# EAGLE design casen (EAGLE 5.04)
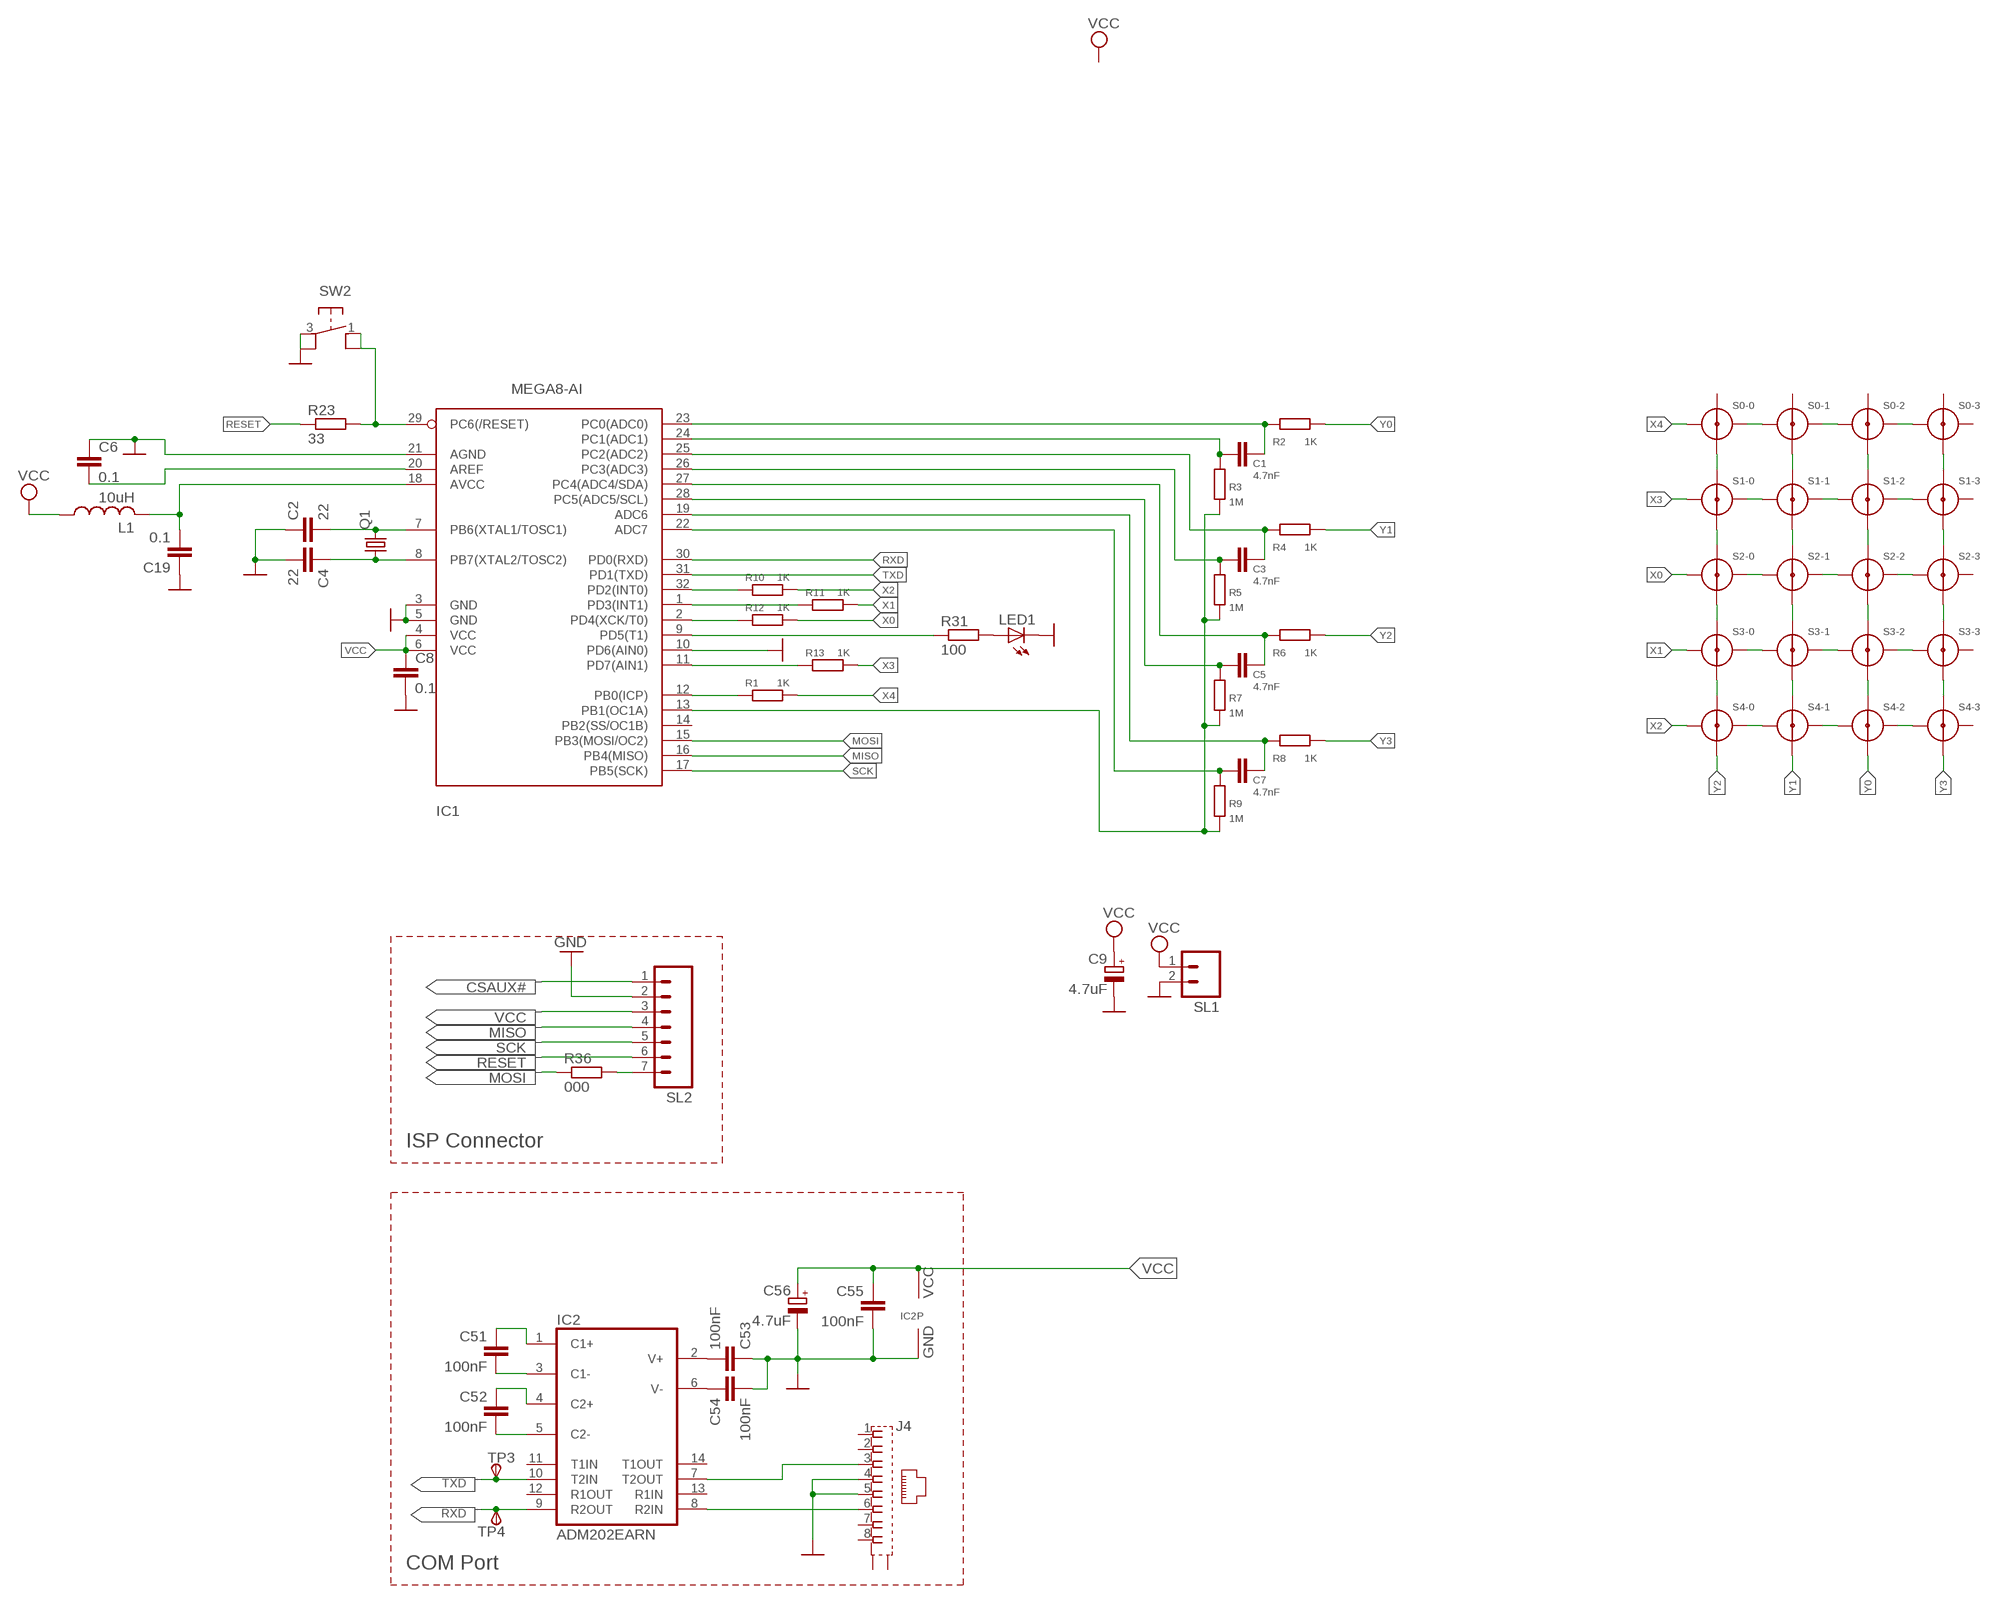
[diagram p0: schematic, sheet 1]

## Parts
C1  4.7nF  C-EUC0805S  [C0805S]
C2  22  C-EUC0805S  [C0805S]
C3  4.7nF  C-EUC0805S  [C0805S]
C4  22  C-EUC0805S  [C0805S]
C5  4.7nF  C-EUC0805S  [C0805S]
C6  0.1  C-EUC0603  [C0603]
C7  4.7nF  C-EUC0805S  [C0805S]
C8  0.1  C-EUC0603  [C0603]
C9  4.7uF  CPOL-EUB/3528-21R  [B/3528-21R]
C19  0.1  C-EUC0603  [C0603]
C51  100nF  C-EUC0603K  [C0603K]
C52  100nF  C-EUC0603K  [C0603K]
C53  100nF  C-EUC0603K  [C0603K]
C54  100nF  C-EUC0603K  [C0603K]
C55  100nF  C-EUC0603K  [C0603K]
C56  4.7uF  CPOL-EUA/3216-18R  [A/3216-18R]
IC1  MEGA8-AI  [TQFP32-08]
IC2  ADM202EARN  [SO16]
J4  558310-1  [558310-1]
L1  10uH  L-USL3216C  [L3216C]
LED1  LEDCHIP-LED0805  [CHIP-LED0805]
Q1  CRYTALHC49S  [HC49/S]
R1  1K  R-EU_R0805S  [R0805-SVO]
R2  1K  R-EU_R0805S  [R0805-SVO]
R3  1M  R-EU_R0805S  [R0805-SVO]
R4  1K  R-EU_R0805S  [R0805-SVO]
R5  1M  R-EU_R0805S  [R0805-SVO]
R6  1K  R-EU_R0805S  [R0805-SVO]
R7  1M  R-EU_R0805S  [R0805-SVO]
R8  1K  R-EU_R0805S  [R0805-SVO]
R9  1M  R-EU_R0805S  [R0805-SVO]
R10  1K  R-EU_R0805S  [R0805-SVO]
R11  1K  R-EU_R0805S  [R0805-SVO]
R12  1K  R-EU_R0805S  [R0805-SVO]
R13  1K  R-EU_R0805S  [R0805-SVO]
R23  33  R-EU_R0805S  [R0805-SVO]
R31  100  R-EU_R0402  [R0402]
R36  000  R-EU_R0805S  [R0805-SVO]
S0-0  CAPSENSOR110MM  [CAPSENSOR10MM]
S0-1  CAPSENSOR110MM  [CAPSENSOR10MM]
S0-2  CAPSENSOR110MM  [CAPSENSOR10MM]
S0-3  CAPSENSOR110MM  [CAPSENSOR10MM]
S1-0  CAPSENSOR110MM  [CAPSENSOR10MM]
S1-1  CAPSENSOR110MM  [CAPSENSOR10MM]
S1-2  CAPSENSOR110MM  [CAPSENSOR10MM]
S1-3  CAPSENSOR110MM  [CAPSENSOR10MM]
S2-0  CAPSENSOR110MM  [CAPSENSOR10MM]
S2-1  CAPSENSOR110MM  [CAPSENSOR10MM]
S2-2  CAPSENSOR110MM  [CAPSENSOR10MM]
S2-3  CAPSENSOR110MM  [CAPSENSOR10MM]
S3-0  CAPSENSOR110MM  [CAPSENSOR10MM]
S3-1  CAPSENSOR110MM  [CAPSENSOR10MM]
S3-2  CAPSENSOR110MM  [CAPSENSOR10MM]
S3-3  CAPSENSOR110MM  [CAPSENSOR10MM]
S4-0  CAPSENSOR110MM  [CAPSENSOR10MM]
S4-1  CAPSENSOR110MM  [CAPSENSOR10MM]
S4-2  CAPSENSOR110MM  [CAPSENSOR10MM]
S4-3  CAPSENSOR110MM  [CAPSENSOR10MM]
SL1  M02  [02P]
SL2  M07  [07P]
SW2  BUTTON_6X6_THRU  [6X6_BUTTON_THRU]
TP3  TPSTP18SQ  [TP18SQ]
TP4  TPSTP18SQ  [TP18SQ]

## Nets
COM_RXD: IC2.8(R2IN) J4.6
COM_TXD: IC2.7(T2OUT) J4.3
CSAUX#: SL2.1
GND: C2.1 C4.2 C6.1 C8.2 C9.- C19.1 C53.1 C54.2 C55.2 C56.- IC1.3(GND) IC1.5(GND) IC1.10(PD6(AIN0)) IC1.21(AGND) IC2.15(GND) J4.4 J4.5 LED1.C SL1.2 SL2.2 SW2.3(P1) SW2.4(P1)
MISO: IC1.16(PB4(MISO)) SL2.4
MOSI: IC1.15(PB3(MOSI/OC2)) R36.1
N$1: S0-0.Y$2 S1-0.Y$1
N$2: S1-0.Y$2 S2-0.Y$1
N$3: S2-0.Y$2 S3-0.Y$1
N$4: C51.2 IC2.3(C1-)
N$5: IC1.12(PB0(ICP)) R1.1
N$6: C6.2 IC1.20(AREF)
N$7: C51.1 IC2.1(C1+)
N$8: C52.1 IC2.4(C2+)
N$9: C52.2 IC2.5(C2-)
N$10: C53.2 IC2.2(V+)
N$11: S0-1.Y$2 S1-1.Y$1
N$12: S1-1.Y$2 S2-1.Y$1
N$13: S2-1.Y$2 S3-1.Y$1
N$14: S3-1.Y$2 S4-1.Y$1
N$15: C1.1 IC1.23(PC0(ADC0)) R2.1
N$16: C1.2 IC1.24(PC1(ADC1)) R3.1
N$17: C3.1 IC1.25(PC2(ADC2)) R4.1
N$18: C3.2 IC1.26(PC3(ADC3)) R5.1
N$19: C5.1 IC1.27(PC4(ADC4/SDA)) R6.1
N$20: C5.2 IC1.28(PC5(ADC5/SCL)) R7.1
N$21: C7.1 IC1.19(ADC6) R8.1
N$22: C7.2 IC1.22(ADC7) R9.1
N$23: IC1.29(PC6(/RESET)) R23.2 SW2.1(P2) SW2.2
N$24: S3-0.Y$2 S4-0.Y$1
N$25: S0-0.X$2 S0-1.X$1
N$26: C19.2 IC1.18(AVCC) L1.2
N$27: IC1.32(PD2(INT0)) R10.1
N$28: C2.2 IC1.7(PB6(XTAL1/TOSC1)) Q1.2
N$29: C4.1 IC1.8(PB7(XTAL2/TOSC2)) Q1.1
N$30: IC1.1(PD3(INT1)) R11.1
N$31: IC1.2(PD4(XCK/T0)) R12.1
N$32: IC1.11(PD7(AIN1)) R13.1
N$33: S1-0.X$2 S1-1.X$1
N$34: S2-0.X$2 S2-1.X$1
N$35: S3-0.X$2 S3-1.X$1
N$36: S4-0.X$2 S4-1.X$1
N$37: S0-2.Y$2 S1-2.Y$1
N$38: S1-2.Y$2 S2-2.Y$1
N$39: S2-2.Y$2 S3-2.Y$1
N$40: S3-2.Y$2 S4-2.Y$1
N$41: S0-1.X$2 S0-2.X$1
N$42: S1-1.X$2 S1-2.X$1
N$43: S2-1.X$2 S2-2.X$1
N$44: S3-1.X$2 S3-2.X$1
N$45: S4-1.X$2 S4-2.X$1
N$46: S0-3.Y$2 S1-3.Y$1
N$47: S1-3.Y$2 S2-3.Y$1
N$48: S2-3.Y$2 S3-3.Y$1
N$49: LED1.A R31.2
N$50: S3-3.Y$2 S4-3.Y$1
N$51: IC1.9(PD5(T1)) R31.1
N$52: S0-2.X$2 S0-3.X$1
N$53: S1-2.X$2 S1-3.X$1
N$54: S2-2.X$2 S2-3.X$1
N$55: S3-2.X$2 S3-3.X$1
N$56: S4-2.X$2 S4-3.X$1
N$57: C54.1 IC2.6(V-)
N$78: R36.2 SL2.7
RESET: R23.1 SL2.6
RXD: IC1.30(PD0(RXD)) IC2.9(R2OUT) TP4.TP(PP)
SCK: IC1.17(PB5(SCK)) SL2.5
SLOPE: IC1.13(PB1(OC1A)) R3.2 R5.2 R7.2 R9.2
TXD: IC1.31(PD1(TXD)) IC2.10(T2IN) TP3.TP(PP)
VCC: C8.1 C9.+ C55.1 C56.+ IC1.4(VCC) IC1.6(VCC) IC2.16(VCC) L1.1 SL1.1 SL2.3
X0: R12.2 S2-0.X$1
X1: R11.2 S3-0.X$1
X2: R10.2 S4-0.X$1
X3: R13.2 S1-0.X$1
X4: R1.2 S0-0.X$1
Y0: R2.2 S4-2.Y$2
Y1: R4.2 S4-1.Y$2
Y2: R6.2 S4-0.Y$2
Y3: R8.2 S4-3.Y$2
Unconnected: IC1.14(PB2(SS/OC1B)) IC2.11(T1IN) IC2.12(R1OUT) IC2.13(R1IN) IC2.14(T1OUT) J4.1 J4.2 J4.7 J4.8 J4.G1(S2) J4.G2(S1) S0-0.Y$1 S0-1.Y$1 S0-2.Y$1 S0-3.X$2 S0-3.Y$1 S1-3.X$2 S2-3.X$2 S3-3.X$2 S4-3.X$2

## Notes on the sheet
- ISP Connector
- COM Port

## Library data of the parts
C1-C8 C19 C51-C55 = rcl:C-EU: CAPACITOR, European symbol
C9 C56 = rcl:CPOL-EU: POLARIZED CAPACITOR, European symbol
IC1 = atmel:MEGA8: MICROCONTROLLER 8 Kbytes FLASH, 1 kbytes SRAM, 512 bytes EEPROM, USART, 6-channel 10 bit ADC, 2-channel 8 bit ADC Pin compatible with Atmega48, ATMega88, ATMega168 Source: avr.lbr
IC2 = 0-ADI-variety:ADM202E*
J4 = con-amp:558310-1: AMP connector
L1 = rcl:L-US: INDUCTOR, American symbol
LED1 = led:LED: LED OSRAM: - CHIPLED LG R971, LG N971, LY N971, LG Q971, LY Q971, LO R971, LY R971 LH N974, LH R974 LS Q976, LO Q976, LY Q976 LO Q996 - Hyper CHIPLED LW Q18S LB Q993, LB Q99A, LB R99A - SideLED LS A670, LO A670, LY A670, LG A670, LP A670 LB A673, LV A673, LT A673, LW A673 LH A674 LY A675 LS A676, LA A676, LO A676, LY A676, LW A676 LS A679, LY A679, LG A679 - Hyper Micro SIDELED® LS Y876, LA Y876, LO Y876, LY Y876 LT Y87S - SmartLED LW L88C, LW L88S LB L89C, LB L89S, LG L890 LS L89K, LO L89K, LY L89K LS L896, LA L896, LO L896, LY L896 - TOPLED LS T670, LO T670, LY T670, LG T670, LP T670 LSG T670, LSP T670, LSY T670, LOP T670, LYG T670 LG T671, LOG T671, LSG T671 LB T673, LV T673, LT T673, LW T673 LH T674 LS T676, LA T676, LO T676, LY T676, LB T676, LH T676, LSB T676, LW T676 LB T67C, LV T67C, LT T67C, LS T67K, LO T67K, LY T67K, LW E67C LS E67B, LA E67B, LO E67B, LY E67B, LB E67C, LV E67C, LT E67C LW T67C LS T679, LY T679, LG T679 LS T770, LO T770, LY T770, LG T770, LP T770 LB T773, LV T773, LT T773, LW T773 LH T774 LS E675, LA E675, LY E675, LS T675 LS T776, LA T776, LO T776, LY T776, LB T776 LHGB T686 LT T68C, LB T68C - Hyper Mini TOPLED® LB M676 - Mini TOPLED Santana® LG M470 LS M47K, LO M47K, LY M47K Source: http://www.osram.convergy.de/
Q1 = crystal:CRYTAL: CRYSTAL
R1-R13 R23 R31 R36 = rcl:R-EU_: RESISTOR, European symbol
S0-0 S0-1-S0-3 S1-0 S1-1-S1-3 S2-0 S2-1-S2-3 S3-0 S3-1-S3-3 S4-0 S4-1-S4-3 = 0-svo:CAPSENSOR1
SL1 = con-amp-quick:M02: AMP QUICK CONNECTOR
SL2 = con-amp-quick:M07: AMP QUICK CONNECTOR
SW2 = 0-svo:BUTTON_6X6_*
TP3 TP4 = testpad:TPS: TEST PIN

## Board
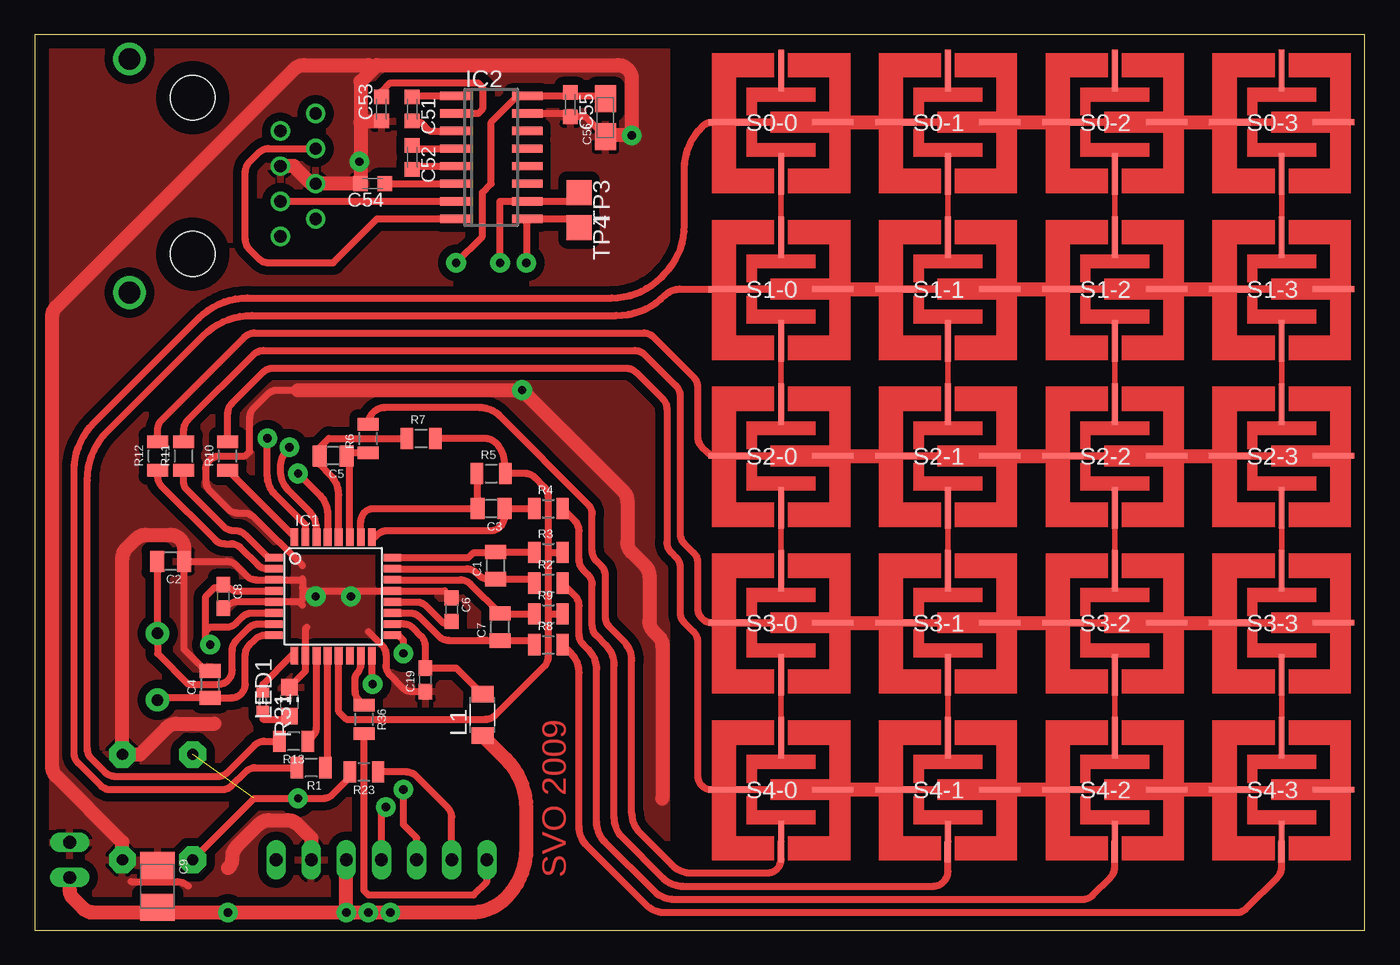
[diagram p1: board, top side]
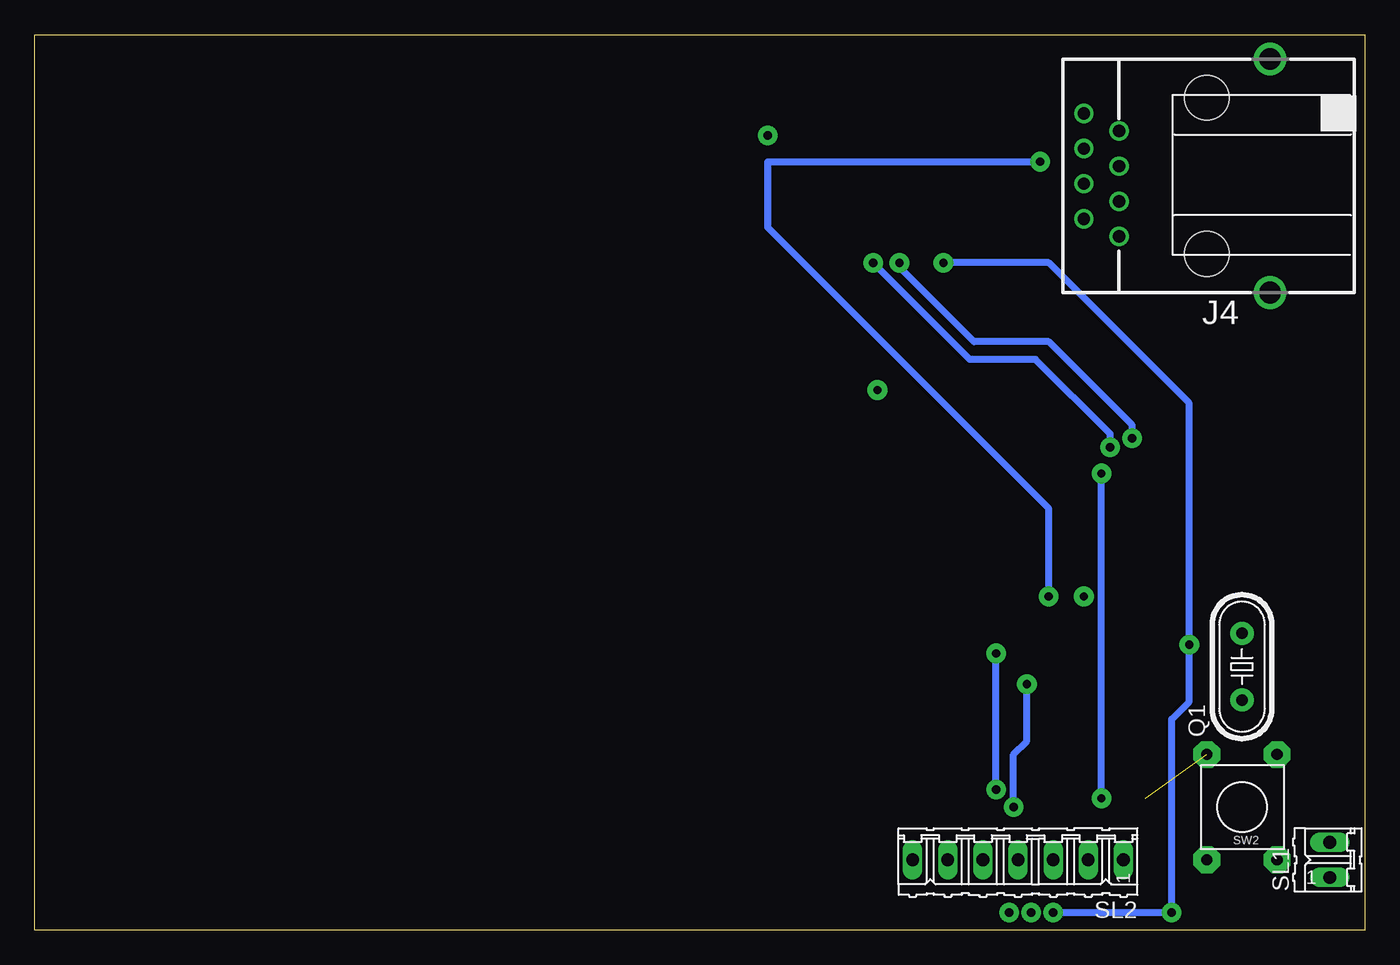
[diagram p2: board, bottom side, seen from below]

Size 96.19 x 64.76 mm. Coordinates in mm from the lower left corner, seen from the top.
Outline: 0,0 96.19,0 96.19,64.76 0,64.76 0,0
Copper layers (1*16): Top 0.035mm / dielectric 1.5mm / Bottom 0.035mm
Design rules "default": minimum track width 10mil, minimum drill 24mil, track to track 8mil, track to pad 8mil, pad to pad 8mil, via to via 8mil, smd to smd 8mil, copper to edge 40mil, drill to drill 8mil, minimum pad ring 10mil, minimum via ring 8mil, stop-mask expansion 4mil, vias tented up to drill 0mil, thermal gap 10mil

### Footprints (pad centres in the part's own frame; a part is rotated, then mirrored left to right if it is on the bottom)
C0805S = smd 1.016 x 1.524: 1 -0.977,0; 2 0.977,0
C0603 = smd 1.1 x 1: 1 -0.85,0; 2 0.85,0
B/3528-21R = smd 1.95 x 2.5: + 1.525,0; - -1.525,0
C0603K = smd 1.05 x 1.08: 1 -0.875,0; 2 0.875,0
A/3216-18R = smd 1.95 x 1.5: + 1.375,0; - -1.375,0
TQFP32-08 = smd 1.27 x 0.559: 1 -4.293,2.8; 2 -4.293,2; 3 -4.293,1.2; 4 -4.293,0.4; 5 -4.293,-0.4; 6 -4.293,-1.2; 7 -4.293,-2; 8 -4.293,-2.8; 17 4.293,-2.8; 18 4.293,-2; 19 4.293,-1.2; 20 4.293,-0.4; 21 4.293,0.4; 22 4.293,1.2; 23 4.293,2; 24 4.293,2.8 | smd 0.559 x 1.27: 9 -2.8,-4.293; 10 -2,-4.293; 11 -1.2,-4.293; 12 -0.4,-4.293; 13 0.4,-4.293; 14 1.2,-4.293; 15 2,-4.293; 16 2.8,-4.293; 25 2.8,4.293; 26 2,4.293; 27 1.2,4.293; 28 0.4,4.293; 29 -0.4,4.293; 30 -1.2,4.293; 31 -2,4.293; 32 -2.8,4.293
SO16 = smd 0.6 x 2.2: 1 -4.445,-2.6; 2 -3.175,-2.6; 3 -1.905,-2.6; 4 -0.635,-2.6; 5 0.635,-2.6; 6 1.905,-2.6; 7 3.175,-2.6; 8 4.445,-2.6; 9 4.445,2.6; 10 3.175,2.6; 11 1.905,2.6; 12 0.635,2.6; 13 -0.635,2.6; 14 -1.905,2.6; 15 -3.175,2.6; 16 -4.445,2.6
558310-1 = drill 0.889 round: 1 -4.445,6.35; 2 -3.175,8.89; 3 -1.905,6.35; 4 -0.635,8.89; 5 0.635,6.35; 6 1.905,8.89; 7 3.175,6.35; 8 4.445,8.89 | drill 1.575 pad 2.184 round: G1 -8.509,-4.572; G2 8.382,-4.572 | hole 3.251: -5.715,0; 5.588,0
L3216C = smd 1.2 x 1.6: 1 -1.5,0; 2 1.5,0
CHIP-LED0805 = smd 1.2 x 1.2: A 0,-1.05; C 0,1.05
HC49/S = drill 0.813 pad 1.676 round: 1 -2.413,0; 2 2.413,0
R0805-SVO = smd 0.9 x 1.524: 1 -1.027,0; 2 1.027,0
R0402 = smd 0.7 x 0.9: 1 -0.65,0; 2 0.65,0
CAPSENSOR10MM = smd 3 x 0.406: X$1 -3.75,0; X$2 3.75,0 | smd 0.406 x 3: Y$1 0,3.75; Y$2 0,-3.75
02P = drill 0.914 long: 1 -1.27,0; 2 1.27,0
07P = drill 0.914 long: 1 -7.62,0; 2 -5.08,0; 3 -2.54,0; 4 0,0; 5 2.54,0; 6 5.08,0; 7 7.62,0
6X6_BUTTON_THRU = drill 0.813 pad 1.93 octagon: 1 -2.54,3.81; 2 -2.54,-3.81; 3 2.54,-3.81; 4 2.54,3.81
TP18SQ = smd 1.8 x 1.8: TP 0,0

### Placement (x,y rotation side)
C1  33.34,26.35 90 top
C2  9.84,26.67 180 top
C3  33.02,30.48 180 top
C4  12.7,17.78 90 top
C5  21.59,34.29 180 top
C6  30.16,23.18 270 top
C7  33.66,21.91 90 top
C8  13.65,24.13 270 top
C9  8.89,3.18 270 top
C19  28.26,18.1 90 top
C51  27.3,59.37 270 top
C52  27.3,55.88 270 top
C53  25.08,59.37 90 top
C54  24.45,53.97 180 top
C55  38.73,59.69 270 top
C56  41.27,58.74 90 top
IC1  21.59,24.13 0 top
IC2  33.02,55.88 270 top
J4  11.43,54.61 90 bottom
L1  32.38,15.56 90 top
LED1  18.41,16.51 0 top
Q1  8.89,19.05 90 bottom
R1  20,11.75 180 top
R2  37.15,25.08 0 top
R3  37.15,27.3 0 top
R4  37.15,30.48 0 top
R5  33.02,33.02 0 top
R6  24.13,35.56 90 top
R7  27.94,35.56 0 top
R8  37.15,20.64 0 top
R9  37.15,22.86 0 top
R10  13.97,34.29 90 top
R11  10.79,34.29 90 top
R12  8.89,34.29 90 top
R13  18.73,13.65 180 top
R23  23.81,11.43 180 top
R31  16.51,16.51 270 top
R36  23.81,15.24 270 top
S0-0  53.98,58.42 0 top
S0-1  66.04,58.42 0 top
S0-2  78.11,58.42 0 top
S0-3  90.17,58.42 0 top
S1-0  53.98,46.35 0 top
S1-1  66.04,46.35 0 top
S1-2  78.11,46.35 0 top
S1-3  90.17,46.35 0 top
S2-0  53.98,34.29 0 top
S2-1  66.04,34.29 0 top
S2-2  78.11,34.29 0 top
S2-3  90.17,34.29 0 top
S3-0  53.98,22.23 0 top
S3-1  66.04,22.23 0 top
S3-2  78.11,22.23 0 top
S3-3  90.17,22.23 0 top
S4-0  53.98,10.16 0 top
S4-1  66.04,10.16 0 top
S4-2  78.11,10.16 0 top
S4-3  90.17,10.16 0 top
SL1  2.54,5.08 90 bottom
SL2  25.08,5.08 180 bottom
SW2  8.89,8.89 0 bottom
TP3  39.37,53.34 270 top
TP4  39.37,50.8 270 top

### Tracks (layer width: path | path; a pad name or v marks a point on that pad's centre or on a via)
COM_RXD
  Top 0.5: IC2.8 24.77,51.43 21.59,48.26 16.92,48.26 arc-45 16.22,48.55 15.53,49.24 arc-45 15.24,49.94 15.24,54.83 arc-45 15.53,55.54 16.22,56.22 arc-45 16.92,56.51 J4.6
COM_TXD
  Top 0.5: J4.3 IC2.7
GND  (via drill 0.6 pad 1.42)
  Top 0.5: 19.68,21.91 19.59,21.81 IC1.10 19.59,18.73 LED1.C | 19.13,23.73 IC1.5 14.42,23.73 C8.2 | 19.13,23.73 19.37,23.5 | 19.37,24.77 19.37,23.96 19.13,23.73 | 19.37,24.77 19.37,25.4 19.3,25.33 IC1.3 16.04,25.33 arc-45 15.34,25.62 14.58,26.38 arc45 13.87,26.67 C2.1 10.79,26.65 10.79,20.32 12.36,18.76 C4.2 | 19.37,24.77 19.6,24.53 IC1.21 29.66,24.53 C6.1 | C19.1 27.3,17.25 arc-45 26.59,17.54 25.69,18.44 arc-45 25.4,19.15 25.4,19.91 arc45 25.11,20.61 24.13,21.59 | IC2.15 38.49,59.05 C55.2 39.82,58.81 C56.- | 19.05,39.05 17.56,39.05 arc45 16.85,38.76 15.85,37.76 arc45 15.56,37.05 15.56,34.61 15.24,34.29 13.38,34.29 arc90 12.38,33.29 12.38,32.48 arc45 12.68,31.78 13.99,30.46 arc45 14.7,30.16 15.14,30.16 arc-45 15.85,29.87 19.37,26.35 | C9.- arc-45 9.48,3.86 9.84,3.49 | 6.99,3.49 9.84,3.49 | 9.84,3.49 10.35,3.49 arc-45 11.11,3.18
  Top 1: J4.4 C54.2 23.57,58.42 | 13.02,14.92 10.26,14.92 arc45 9.55,14.63 7.62,12.7 SW2.4 6.35,26.89 arc-45 6.64,27.6 7.33,28.28 arc-45 8.03,28.57 9.82,28.57 arc-90 10.82,27.57 C2.1 | SL2.2 20,6.67 19.02,7.64 arc45 18.32,7.94 16.92,7.94 arc45 16.22,7.64 14.58,6.01 arc45 14.29,5.3 14.29,5.18 arc-45 13.99,4.47 | 23.57,58.42 23.57,61.35 24.45,62.23 | 24.45,62.23 24.77,62.55 42.18,62.55 arc-90 43.18,61.55 v43.18,57.47 41.38,57.47 C56.- | C53.1 23.65,58.5 23.57,58.42 | SW2.3 6.35,6.35 1.56,11.14 arc-45 1.27,11.84 1.27,44.35 arc-45 1.56,45.06 18.76,62.25 arc-45 19.46,62.55 24.13,62.55 24.45,62.23
  Top 1.016: J4.5 18.73,55.24 20,53.97 J4.4 | 19.05,39.05 v35.24,39.05 42.57,31.72 arc-45 42.86,31.02 42.86,28.04 arc45 43.16,27.33 44.16,26.33 arc-45 44.45,25.62 44.45,22.32 arc45 44.74,21.62 45.11,21.25 arc-45 45.4,20.54 45.4,9.53
  Bottom 0.5: v22.86,24.13 22.86,30.48 43.18,50.8 43.18,55.56 v23.5,55.56
  other vias: 20.32,24.13
  pour Top: 19.05,26.67 19.05,21.59 24.13,21.59 24.13,26.67
  pour Top (isolate 0.61): 0,63.5 0,0 45.72,0 45.72,63.5 45.72,66.04 0,66.04
MISO  (via drill 0.6 pad 1.42)
  Top 0.5: IC1.16 24.39,18.47 v24.45,17.78 | SL2.4 25.08,8.57 v25.4,8.89
  Bottom 0.5: v24.45,17.78 24.45,13.65 25.4,12.7 v25.4,8.89
MOSI
  Top 0.5: IC1.15 23.59,19.24 arc-45 23.3,18.54 arc45 23.18,18.25 23.18,17.32 arc45 23.47,16.61 R36.1
N$1
  Top 0.406: S1-0.Y$1 S0-0.Y$2
N$2
  Top 0.406: S2-0.Y$1 S1-0.Y$2
N$3
  Top 0.406: S3-0.Y$1 S2-0.Y$2
N$4
  Top 0.5: IC2.3 28.57,57.78 27.94,58.42 27.38,58.42 C51.2
N$5
  Top 0.5: IC1.12 21.19,11.91 R1.1
N$6
  Top 0.5: IC1.20 27.61,23.73 arc-45 28.32,23.44 29.53,22.23 30.06,22.23 C6.2
N$7
  Top 0.5: IC2.1 27.38,60.32 C51.1
N$8
  Top 0.5: IC2.4 27.55,56.51 C52.1
N$9
  Top 0.5: IC2.5 27.55,55.24 C52.2
N$10
  Top 0.5: C53.2 25.08,60.64 25.72,61.28 32.07,61.28 32.38,60.96 32.38,59.37 32.07,59.05 IC2.2
N$11
  Top 0.406: S1-1.Y$1 S0-1.Y$2
N$12
  Top 0.406: S2-1.Y$1 S1-1.Y$2
N$13
  Top 0.406: S3-1.Y$1 S2-1.Y$2
N$14
  Top 0.406: S4-1.Y$1 S3-1.Y$2
N$15
  Top 0.5: IC1.23 31.24,26.13 arc-45 31.95,25.84 32.09,25.69 arc45 32.8,25.4 33.31,25.4 C1.1 35.83,25.38 R2.1
N$16
  Top 0.5: IC1.24 31.38,26.93 31.75,27.3 33.31,27.3 C1.2 36.1,27.33 R3.1
N$17
  Top 0.5: IC1.25 24.61,28.42 24.79,28.6 arc-45 25.5,28.89 32.97,28.89 arc90 33.97,29.89 33.97,30.46 C3.1 R4.1
N$18
  Top 0.5: R5.1 32.04,32.97 C3.2 24.48,30.48 arc45 23.88,30.23 arc45 23.59,29.53 IC1.26
N$19
  Top 0.5: IC1.27 22.79,34.07 C5.1 22.81,34.53 R6.1
N$20
  Top 0.5: C5.2 20.56,34.34 | C5.2 20.64,34.31 20.64,34.92 21.27,35.56 R7.1 | IC1.28 21.99,31.47 arc45 21.4,32.89 20.64,33.65 20.64,34.26 C5.2
N$21
  Top 0.5: C7.1 35.83,20.93 R8.1 | C7.1 33.31,20.96 | 32.7,20.96 33.63,20.96 C7.1 | 32.7,20.96 32.07,20.96 | IC1.19 27.14,22.93 arc-45 27.84,22.64 29.23,21.25 arc45 29.94,20.96 32.7,20.96
N$22
  Top 0.5: R9.1 33.36,22.86 C7.2 31.5,25.04 arc45 30.8,25.33 IC1.22
N$23  (via drill 0.6 pad 1.42)  (1 unrouted)
  Top 0.5: v19.05,33.02 20.6,31.47 arc-45 21.19,30.05 IC1.29 | R23.2 22.79,11.04 21.57,9.82 arc-45 20.86,9.53 v19.05,9.53 15.88,9.53 SW2.2
  Bottom 0.5: v19.05,9.53 v19.05,33.02
N$24
  Top 0.406: S4-0.Y$1 S3-0.Y$2
N$25
  Top 1.016: S0-0.X$2 S0-1.X$1
N$26
  Top 0.5: IC1.18 26.67,22.13 arc-45 27.38,21.84 27.96,21.25 arc-45 28.26,20.54 C19.2 30.5,18.95 L1.2
N$27
  Top 0.5: IC1.32 18.79,28.44 R10.1
N$28
  Top 0.5: IC1.7 16.19,22.13 arc45 15.49,21.84 14.58,20.93 arc45 14.29,20.22 14.29,18.78 arc-90 13.29,17.78 11.11,17.78 8.89,20 Q1.2 8.89,26.65 C2.2
N$29
  Top 0.5: C4.1 12.53,16.64 | C4.1 14.24,16.8 arc90 15.24,17.8 15.24,19.91 arc-45 15.53,20.61 15.96,21.04 arc-45 16.66,21.33 IC1.8 | Q1.1 9.02,16.64 9.21,16.83 12.68,16.83 C4.1
N$30
  Top 0.5: 10.95,31.91 11.11,31.75 | 10.95,31.91 arc-45 10.79,32.29 R11.1 | IC1.1 16.89,26.93 15.21,28.6 arc45 14.51,28.89 14.38,28.89 arc-45 13.68,29.18 10.95,31.91
N$31
  Top 0.5: IC1.2 16.83,26.13 arc-45 16.12,26.42 14.9,27.65 arc45 14.19,27.94 13.75,27.94 arc-45 13.04,28.23 9.18,32.09 arc-45 8.89,32.8 R12.1
N$32
  Top 0.5: R13.1 20.1,13.99 arc45 20.39,14.7 IC1.11
N$33
  Top 1.016: S1-0.X$2 S1-1.X$1
N$34
  Top 1.016: S2-0.X$2 S2-1.X$1
N$35
  Top 1.016: S3-0.X$2 S3-1.X$1
N$36
  Top 1.016: S4-0.X$2 S4-1.X$1
N$37
  Top 0.406: S1-2.Y$1 S0-2.Y$2
N$38
  Top 0.406: S2-2.Y$1 S1-2.Y$2
N$39
  Top 0.406: S3-2.Y$1 S2-2.Y$2
N$40
  Top 0.406: S4-2.Y$1 S3-2.Y$2
N$41
  Top 1.016: S0-1.X$2 S0-2.X$1
N$42
  Top 1.016: S1-1.X$2 S1-2.X$1
N$43
  Top 1.016: S2-1.X$2 S2-2.X$1
N$44
  Top 1.016: S3-1.X$2 S3-2.X$1
N$45
  Top 1.016: S4-1.X$2 S4-2.X$1
N$46
  Top 0.406: S1-3.Y$1 S0-3.Y$2
N$47
  Top 0.406: S2-3.Y$1 S1-3.Y$2
N$48
  Top 0.406: S3-3.Y$1 S2-3.Y$2
N$49
  Top 0.5: R31.2 16.51,15.24 18.2,15.24 LED1.A
N$50
  Top 0.406: S4-3.Y$1 S3-3.Y$2
N$51
  Top 0.5: IC1.9 18.57,19.84 16.51,17.78 R31.1
N$52
  Top 1.016: S0-2.X$2 S0-3.X$1
N$53
  Top 1.016: S1-2.X$2 S1-3.X$1
N$54
  Top 1.016: S2-2.X$2 S2-3.X$1
N$55
  Top 1.016: S3-2.X$2 S3-3.X$1
N$56
  Top 1.016: S4-2.X$2 S4-3.X$1
N$57
  Top 0.5: C54.1 IC2.6
N$78
  Top 0.5: R36.2 23.81,2.86 24.13,2.54 31.75,2.54 32.7,3.49 SL2.7
RESET
  Top 0.5: SL2.6 30.16,8.16 arc45 29.87,8.87 27.6,11.14 arc45 26.89,11.43 R23.1
RXD  (via drill 0.6 pad 1.42)
  Top 0.5: IC1.30 20.39,28.95 arc45 19.8,30.36 18.37,31.8 arc-45 17.78,33.21 17.78,33.46 arc-45 18.37,34.88 v18.41,34.92 | TP4.TP 38.73,51.43 IC2.9 35.62,48.32 v35.56,48.26
  Bottom 0.5: v18.41,34.92 18.41,35.88 23.81,41.27 28.57,41.27 v35.56,48.26
SCK  (via drill 0.6 pad 1.42)
  Top 0.5: IC1.17 26.3,21.33 26.67,20.96 v26.67,20 | SL2.5 27.62,6.67 26.67,7.62 v26.67,10.16
  Bottom 0.5: v26.67,10.16 v26.67,20
SLOPE
  Top 0.5: 37.15,22.86 R9.2 | 37.15,27.3 R3.2 | 37.15,22.86 37.15,27.3 | 37.15,27.3 37.15,31.34 arc45 36.85,32.04 36.17,32.73 arc45 35.46,33.02 R5.2 33.97,33.09 33.97,33.78 arc45 33.39,35.19 arc45 32.5,35.56 R7.2 | IC1.13 21.99,15.79 22.54,15.24 32.61,15.24 arc45 33.31,15.53 36.85,19.07 arc45 37.15,19.78 37.15,22.86
TXD  (via drill 0.6 pad 1.42)
  Top 0.5: IC1.31 19.59,29.3 17.41,31.48 arc-45 16.83,32.9 v16.83,35.56 | TP3.TP 38.73,52.7 IC2.10 33.66,52.7 v33.66,48.26
  Bottom 0.5: v16.83,35.56 16.83,36.51 22.86,42.54 28.26,42.54 33.66,47.94 v33.66,48.26
VCC  (via drill 0.6 pad 1.42)
  Top 0.5: IC1.4 14.42,24.53 C8.1 13.76,24.77 13.02,24.77 12.38,24.13 12.38,21.59 | IC1.6 15.72,22.93 arc45 15.02,22.64 14.58,22.2 arc-45 13.87,21.91 12.7,21.91 12.38,21.59 | C56.+ 41.27,60.32 38.98,60.32 C55.1 38.49,60.32 IC2.16 34.92,60.32 33.02,58.42 33.02,53.97 32.38,53.34 32.38,50.16 v30.48,48.26 | 12.38,21.59 12.38,20.96 v12.7,20.64 | 8.57,1.27 C9.+
  Top 1: v22.54,1.27 SL2.3 | v22.54,1.27 v24.13,1.27 v25.72,1.27 31.5,1.27 arc45 34.1,2.35 arc45 35.56,5.88 35.56,8.81 arc45 34.1,12.35 L1.1 | SL1.1 2.54,2.95 arc45 2.83,2.25 3.52,1.56 arc45 4.22,1.27 8.57,1.27 v22.54,1.27
  Bottom 0.5: v22.54,1.27 v13.97,1.27 13.97,15.24 12.7,16.51 v12.7,20.64 12.7,38.1 22.86,48.26 v30.48,48.26
X0
  Top 0.5: S2-0.X$1 49.31,34.29 arc-45 48.6,34.58 48.23,34.95 arc-45 47.94,35.66 47.94,39.27 arc45 47.65,39.98 44.74,42.89 arc45 44.04,43.18 15.9,43.18 arc45 15.19,42.89 9.18,36.88 arc45 8.89,36.17 R12.2
X1
  Top 0.5: S3-0.X$1 48.99,22.23 arc-45 48.28,22.52 48.23,22.57 arc-45 47.94,23.27 47.94,26.57 arc45 47.65,27.28 46.97,27.96 arc-45 46.67,28.67 46.67,38.64 arc45 46.38,39.34 44.11,41.62 arc45 43.4,41.91 16.53,41.91 arc45 15.82,41.62 11.09,36.88 arc45 10.79,36.17 R11.2
X2
  Top 0.5: S4-0.X$1 48.94,10.16 arc-90 47.94,11.16 47.94,20.86 arc45 47.65,21.57 46.97,22.25 arc-45 46.67,22.96 46.67,26.26 arc45 46.38,26.96 46.01,27.33 arc-45 45.72,28.04 45.72,37.69 arc45 45.43,38.39 43.47,40.35 arc45 42.77,40.64 17.24,40.64 arc45 16.54,40.35 14.26,38.07 arc45 13.97,37.37 R10.2
X3
  Top 0.5: S1-0.X$1 46.66,46.35 arc45 45.6,45.91 arc-45 42.06,44.45 15.72,44.45 arc45 12.19,42.98 5.27,36.07 arc45 3.81,32.54 3.81,13.11 arc45 4.1,12.41 5.11,11.41 arc45 5.81,11.11 13.24,11.11 arc45 13.95,11.41 15.9,13.36 arc-45 16.61,13.65 R13.2
X4
  Top 0.5: S0-0.X$1 48.99,58.42 arc45 48.28,58.13 arc45 46.99,55 46.99,50.97 arc-45 45.53,47.43 45.28,47.18 arc-45 41.74,45.72 15.41,45.72 arc45 11.87,44.26 4.32,36.71 arc45 2.86,33.17 2.86,12.8 arc45 3.15,12.09 4.79,10.45 arc45 5.49,10.16 13.56,10.16 arc45 14.26,10.45 15.27,11.46 arc-45 15.97,11.75 R1.2
Y0
  Top 0.5: R2.2 39.08,24.18 arc-45 39.37,23.47 39.37,21.37 arc45 39.66,20.66 40.05,20.27 arc-45 40.64,18.86 40.64,7.81 arc45 41.23,6.4 44.82,2.81 arc45 46.23,2.22 75.79,2.22 arc45 76.49,2.52 77.81,3.84 arc45 78.11,4.54 S4-2.Y$2
Y1
  Top 0.5: 38.1,30.48 R4.2 39.08,29.58 arc-45 39.37,28.87 39.37,26.77 arc45 39.66,26.06 40.03,25.69 arc-45 40.32,24.99 40.32,22 arc45 40.62,21.3 41.32,20.59 arc-45 41.91,19.17 41.91,8.13 arc45 42.5,6.72 45.45,3.76 arc45 46.87,3.18 64.99,3.18 arc45 65.7,3.47 65.75,3.52 arc45 66.04,4.22 S4-1.Y$2
Y2
  Top 0.5: R6.2 arc-90 25.33,37.78 32.19,37.78 arc-45 33.61,37.2 40.03,30.77 arc-45 40.32,30.07 40.32,27.4 arc45 40.62,26.7 40.98,26.33 arc-45 41.27,25.62 41.27,22.64 arc45 41.57,21.93 42.59,20.91 arc-45 43.18,19.49 43.18,8.45 arc45 43.77,7.03 46.09,4.71 arc45 47.5,4.13 52.98,4.13 arc90 53.98,5.13 S4-0.Y$2
Y3
  Top 0.5: R8.2 38.78,20.03 arc-45 39.37,18.61 39.37,7.5 arc45 39.96,6.08 44.18,1.86 arc45 45.6,1.27 86.9,1.27 arc45 87.61,1.56 89.88,3.84 arc45 90.17,4.54 S4-3.Y$2

### Text on the board
Top: SVO 2009